# Altium schematic sheet Copy of DOAN1.SchDoc
size A; SheetNumber: 2; SheetTotal: 2
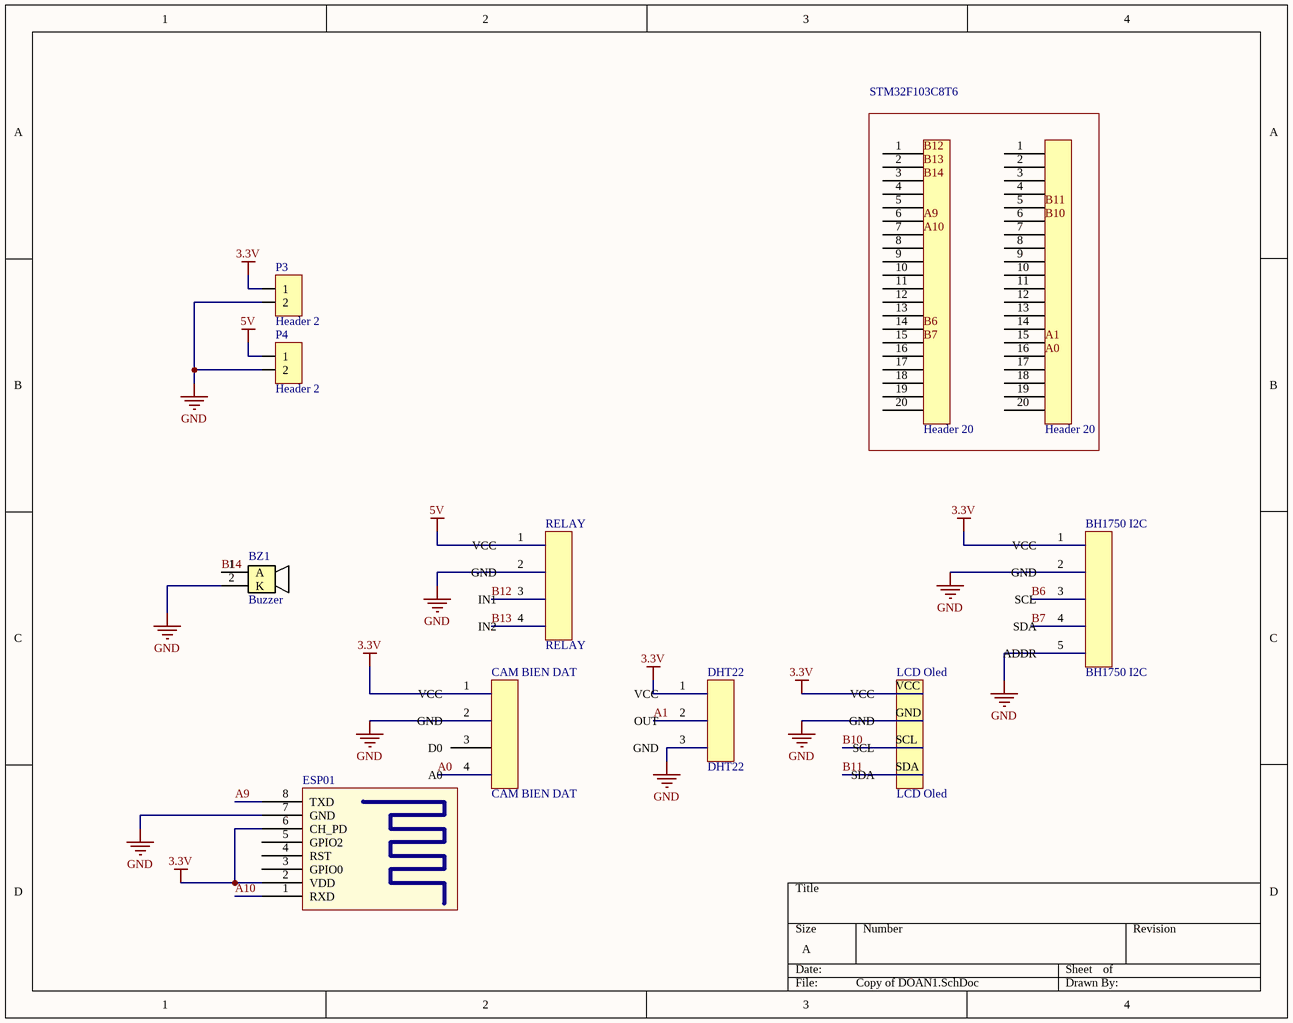
[diagram p0: Copy of DOAN1.SchDoc]

## Parts
(Parts that share a designator on the sheet are numbered #1, #2 ... from top to bottom, then left to right.)
?#1  Header 20  [HDR/Header/20]
?#2  Header 20  [HDR/Header/20]
BH1750_I2C  BH1750 I2C  [HDR/Header/5]
BZ1  Buzzer  [BUZZER]
CAM_BIEN_DAT  CAM BIEN DAT  [HDR/Header/4]
DHT22  DHT22  [HDR/Header/3]
ESP01  Component_1  [ESP8266 ESP-01]  (value not drawn)
LCD_Oled  LCD Oled  [HDR/Header/4]
P3  Header 2  [HDR/Header/2]
P4  Header 2  [HDR/Header/2]
RELAY  RELAY  [HDR/Header/4]

## Sub-sheets
STM32F103C8T6 = File Name: no entries

## Nets
3.3V: BH1750_I2C.1(VCC) CAM_BIEN_DAT.1(VCC) DHT22.1(VCC) ESP01.2(VDD) ESP01.6(CH_PD) LCD_Oled.VCC P3.1
5V: P4.1 RELAY.1(VCC)
GND: BH1750_I2C.2(GND) BH1750_I2C.5(ADDR) BZ1.2(K) CAM_BIEN_DAT.2(GND) DHT22.3(GND) ESP01.7(GND) LCD_Oled.GND P3.2 P4.2 RELAY.2(GND)
A0: ?#2.16 CAM_BIEN_DAT.4(A0)
A1: ?#2.15 DHT22.2(OUT)
A9: ?#1.6 ESP01.8(TXD)
A10: ?#1.7 ESP01.1(RXD)
B6: ?#1.14 BH1750_I2C.3(SCL)
B7: ?#1.15 BH1750_I2C.4(SDA)
B10: ?#2.6 LCD_Oled.SCL
B11: ?#2.5 LCD_Oled.SDA
B12: ?#1.1 RELAY.3(IN1)
B13: ?#1.2 RELAY.4(IN2)
B14: ?#1.3 BZ1.1(A)

Not connected (* = marked no-connect by the designer): ?#1 4 5 8 9 10 11 12 13 16 17 18 19 20; ?#2 1 2 3 4 7 8 9 10 11 12 13 14 17 18 19 20; CAM_BIEN_DAT 3(D0); ESP01 3(GPIO0) 4(RST) 5(GPIO2)

## Library data of the parts
P3 P4 = Header 2: Header, 2-Pin